# EAGLE design keyfinal (EAGLE 8.6.3)
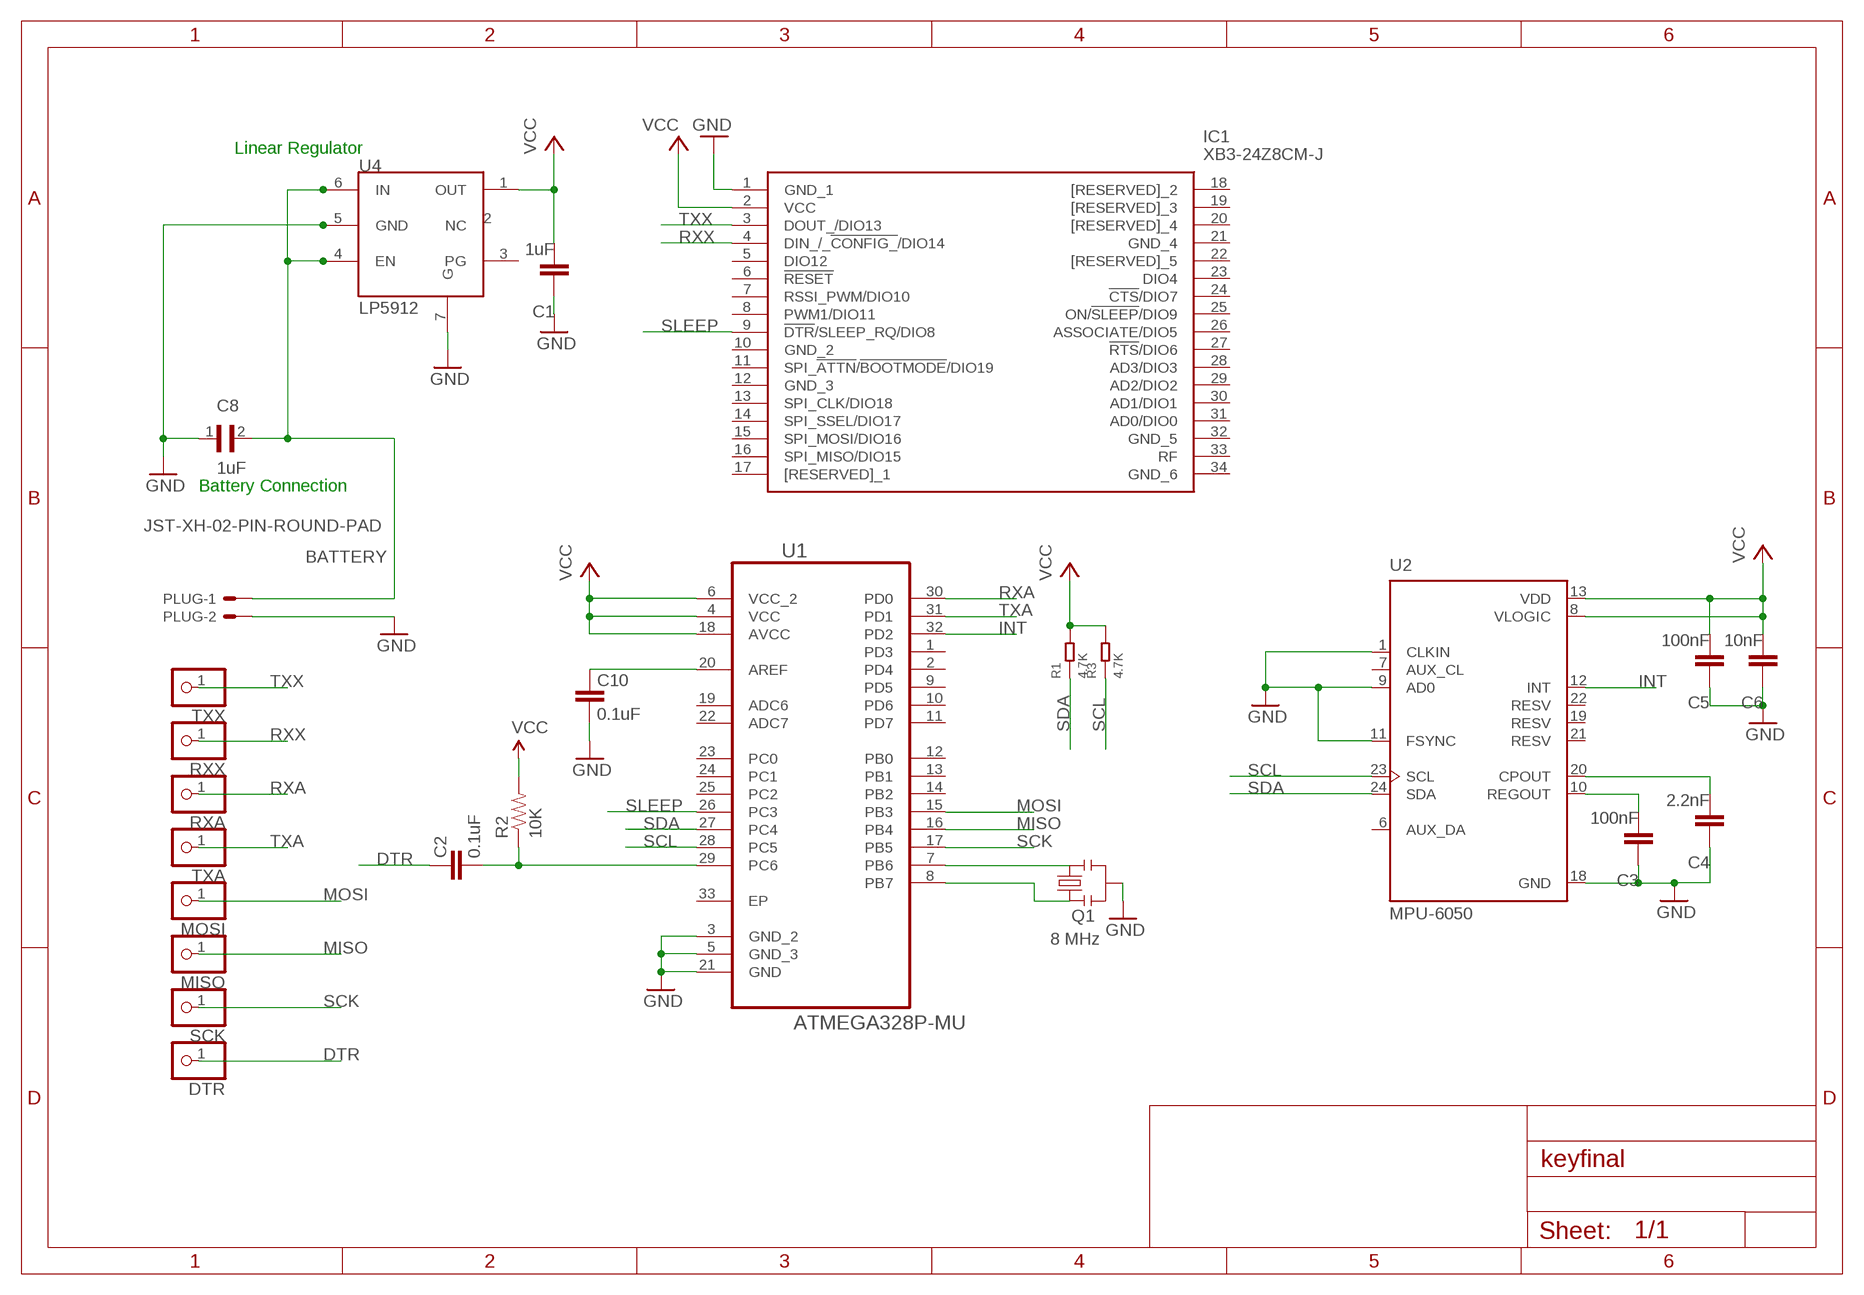
[diagram p0: schematic, sheet 1]

## Parts
C1  1uF  C-EUC0603  [C0603]
C2  0.1uF  CAP0603-CAP  [0603-CAP]
C3  100nF  C-EUC0603  [C0603]
C4  2.2nF  C-EUC0603  [C0603]
C5  100nF  C-EUC0603  [C0603]
C6  10nF  C-EUC0603  [C0603]
C8  1uF  0402YD105MAT2A  [CAPC1005X71N]
C10  0.1uF  CAP0603-CAP  [0603-CAP]
DTR  DTR  PINHD-1X1  [1X01]
IC1  XB3-24Z8CM-J  [XB324Z8CMJ]
MISO  PINHD-1X1  [1X01]
MOSI  PINHD-1X1  [1X01]
PLUG  JST-XH-02-PIN-ROUND-PAD  [JST-XH-02-PACKAGE-ROUND-PAD]
Q1  8 MHz  RESONATOR1:1  [RESONATOR-SMD-1:1]
R1  4.7K  SMD-RES-4.7K-5%-1/16W(0402)  [R0402]
R2  10K  RESISTOR0603-RES  [0603-RES]
R3  4.7K  SMD-RES-4.7K-5%-1/16W(0402)  [R0402]
RXA  PINHD-1X1  [1X01]
RXX  PINHD-1X1  [1X01]
SCK  PINHD-1X1  [1X01]
TXA  PINHD-1X1  [1X01]
TXX  PINHD-1X1  [1X01]
U1  ATMEGA328P-MU  [QFN50P500X500X100-33N]
U2  MPU-6050  [QFN50P400X400X95-24N]
U4  LP5912  [LP5912]

## Nets
BATTERY: C8.2 PLUG.1 U4.4(EN) U4.6(IN)
DTR: C2.2 DTR.1
GND [vcc]: C1.1 C3.1 C4.1 C5.1 C6.1 C8.1 C10.1 IC1.1(GND_1) PLUG.2 Q1.2 U1.3(GND_2) U1.5(GND_3) U1.21(GND) U2.1(CLKIN) U2.9(AD0) U2.11(FSYNC) U2.18(GND) U4.5(GND) U4.7(G)
INT: U1.32(PD2) U2.12(INT)
MISO: MISO.1 U1.16(PB4)
MOSI: MOSI.1 U1.15(PB3)
N$1: C10.2 U1.20(AREF)
N$2: Q1.3 U1.7(PB6)
N$3: C3.2 U2.10(REGOUT)
N$4: C4.2 U2.20(CPOUT)
N$5: Q1.1 U1.8(PB7)
RESET1: C2.1 R2.1 U1.29(PC6)
RXA: RXA.1 U1.30(PD0)
RXX: IC1.4(DIN_/_!CONFIG_!/DIO14) RXX.1
SCK: SCK.1 U1.17(PB5)
SCL: R3.1 U1.28(PC5) U2.23(SCL)
SDA: R1.1 U1.27(PC4) U2.24(SDA)
SLEEP: IC1.9(!DTR!/SLEEP_RQ/DIO8) U1.26(PC3)
TXA: TXA.1 U1.31(PD1)
TXX: IC1.3(DOUT_/DIO13) TXX.1
VCC: C1.2 C5.2 C6.2 IC1.2(VCC) R1.2 R2.2 R3.2 U1.4(VCC) U1.6(VCC_2) U1.18(AVCC) U2.8(VLOGIC) U2.13(VDD) U4.1(OUT)
Unconnected: IC1.5(DIO12) IC1.6(!RESET) IC1.7(RSSI_PWM/DIO10) IC1.8(PWM1/DIO11) IC1.10(GND_2) IC1.11(SPI_!ATTN!/!BOOTMODE!/DIO19) IC1.12(GND_3) IC1.13(SPI_CLK/DIO18) IC1.14(SPI_SSEL/DIO17) IC1.15(SPI_MOSI/DIO16) IC1.16(SPI_MISO/DIO15) IC1.17([RESERVED]_1) IC1.18([RESERVED]_2) IC1.19([RESERVED]_3) IC1.20([RESERVED]_4) IC1.21(GND_4) IC1.22([RESERVED]_5) IC1.23(DIO4) IC1.24(!CTS!/DIO7) IC1.25(ON/!SLEEP!/DIO9) IC1.26(ASSOCIATE/DIO5) IC1.27(!RTS!/DIO6) IC1.28(AD3/DIO3) IC1.29(AD2/DIO2) IC1.30(AD1/DIO1) IC1.31(AD0/DIO0) IC1.32(GND_5) IC1.33(RF) IC1.34(GND_6) U1.1(PD3) U1.2(PD4) U1.9(PD5) U1.10(PD6) U1.11(PD7) U1.12(PB0) U1.13(PB1) U1.14(PB2) U1.19(ADC6) U1.22(ADC7) U1.23(PC0) U1.24(PC1) U1.25(PC2) U1.33(EP) U2.6(AUX_DA) U2.7(AUX_CL) U2.19(RESV) U2.21(RESV) U2.22(RESV) U4.2(NC) U4.3(PG)

## Notes on the sheet
- Linear Regulator
- Battery Connection

## Library data of the parts
C1 C3-C6 = rcl:C-EU: CAPACITOR, European symbol; SPICEPREFIX: C
C2 C10 = SparkFun:CAP: Capacitor Standard 0603 ceramic capacitor, and 0.1" leaded capacitor.
C8 = Capacitor1uF:0402YD105MAT2A: CAP 1UF 16VDC X5R 20% SMD 0402; AVAILABILITY: Unavailable; DESCRIPTION: Cap 1uf 16vdc X5r 20% Smd 0402; MF: AVX; MP: 0402YD105MAT2A; PACKAGE: 1005 AVX; PRICE: None
DTR MISO MOSI RXA RXX TXA TXX = pinhead:PINHD-1X1: PIN HEADER
IC1 = XB3-24Z8CM-J:XB3-24Z8CM-J: Zigbee Modules (802.15.4) XBee3 ,2.4 Ghz ZB 3.0, Chip Ant, MMT Source: Datasheet <https://www.digi.com/resources/documentation/digidocs/pdfs/90001543.pdf>; DESCRIPTION: Zigbee Modules (802.15.4) XBee3 ,2.4 Ghz ZB 3.0, Chip Ant, MMT; HEIGHT: 4mm; MANUFACTURER_NAME: Digi International; MANUFACTURER_PART_NUMBER: XB3-24Z8CM-J; MOUSER_PART_NUMBER: 888-XB3-24Z8CM-J; MOUSER_PRICE-STOCK: https://www.mouser.com/Search/Refine.aspx?Keyword=888-XB3-24Z8CM-J
PLUG = Rembrandt Electronics - JST XH Connectors v1-0:JST-XH-02-PIN: JST XH Connector 2 Pin Wire to board connector. Pitch: 2,54 mm, (0.100") Number of pins: 2 Created by Rembrandt Electronics www.rembrandtelectronics.com
Q1 = Testing:RESONATOR: Resonator Small SMD resonator. This is the itty bitty 10/20MHz resonators with built in caps. CSTCE10M0G55 and CSTCE20M0V53. Footprint for SMD has been used in SFE production for years, and does work okay. 1:1 is an attempt to get larger fillets on the sides so it will be easier to inspect these solders in our AOI machine. The pads have been minimized to match the actual metal under the resonator. To see this relation, it includes an image import of the bottom side of the component. Imported to scale on layer 200.
R1 R3 = RES-4.7K-SMD-5_-1_16W_0402_:SMD-RES-4.7K-5%-1/16W(0402): 301010010; AVAILABILITY: Unavailable; DESCRIPTION: Res Thick Film 0402 4.7K Ohm 5% 0.063W_1/16W_ ?100ppm/C Molded SMD Paper T/R; MF: Yageo; MP: RC0402JR074K7L; PACKAGE: 0402 Yageo; PRICE: None
R2 = SparkFun:RESISTOR: Resistor Basic schematic elements and footprints for 0603, 1206, and PTH resistors.
SCK = pinhead:PINHD-1X1: PIN HEADER; SPICEPREFIX: X
U1 = ATMEGA328P-MU:ATMEGA328P-MU: Programmable Flash; AVAILABILITY: Unavailable; DESCRIPTION: AVR AVR® ATmega Microcontroller IC 8-Bit 20MHz 32KB _16K x 16_ FLASH 32-VQFN _5x5_; MF: Microchip; MP: ATMEGA328P-MU; PACKAGE: VFQFN-32 Adesto Technologies; PRICE: None
U2 = MPU-6050:MPU-6050: MPU-6050 Six-Axis (Gyro + Accelerometer) MEMS MotionTracking™ Devices; AVAILABILITY: Unavailable; DESCRIPTION: 3-axis gyroscope, 3-axis accelerometer in a 4x4x0.9 housing; MF: TDK InvenSense; MP: MPU-6050; PACKAGE: QFN-24 InvenSense; PRICE: None
U4 = electronic-labs:LP5912

## Net classes
0 default: width 0.203 mm
1 vcc: width 0.254 mm

## Board
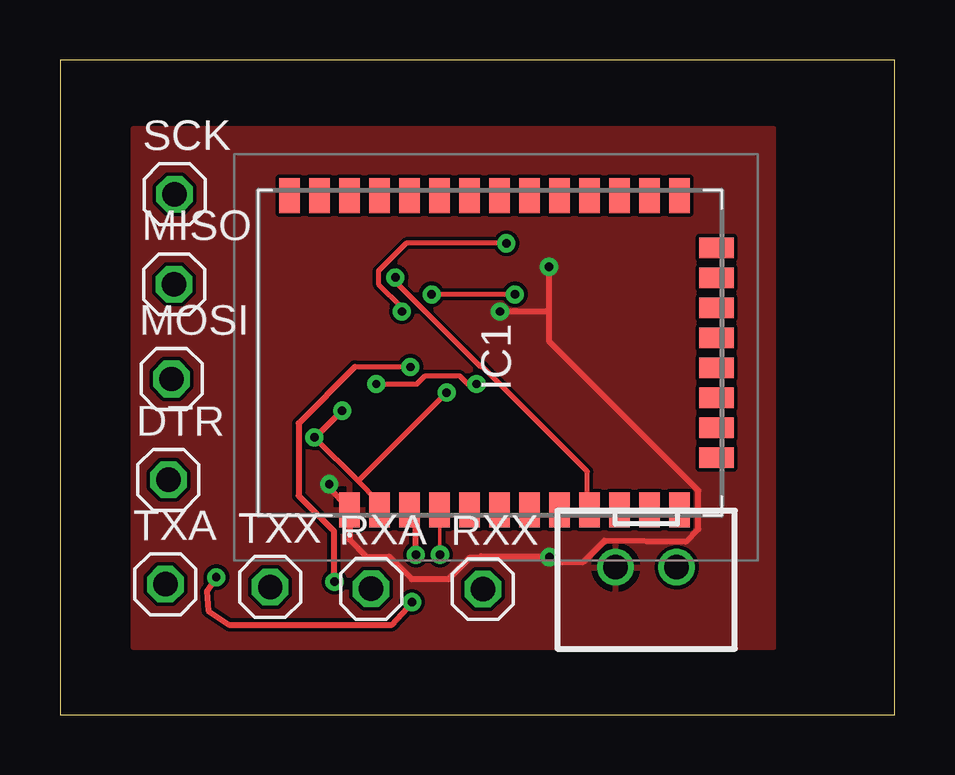
[diagram p1: board, top side]
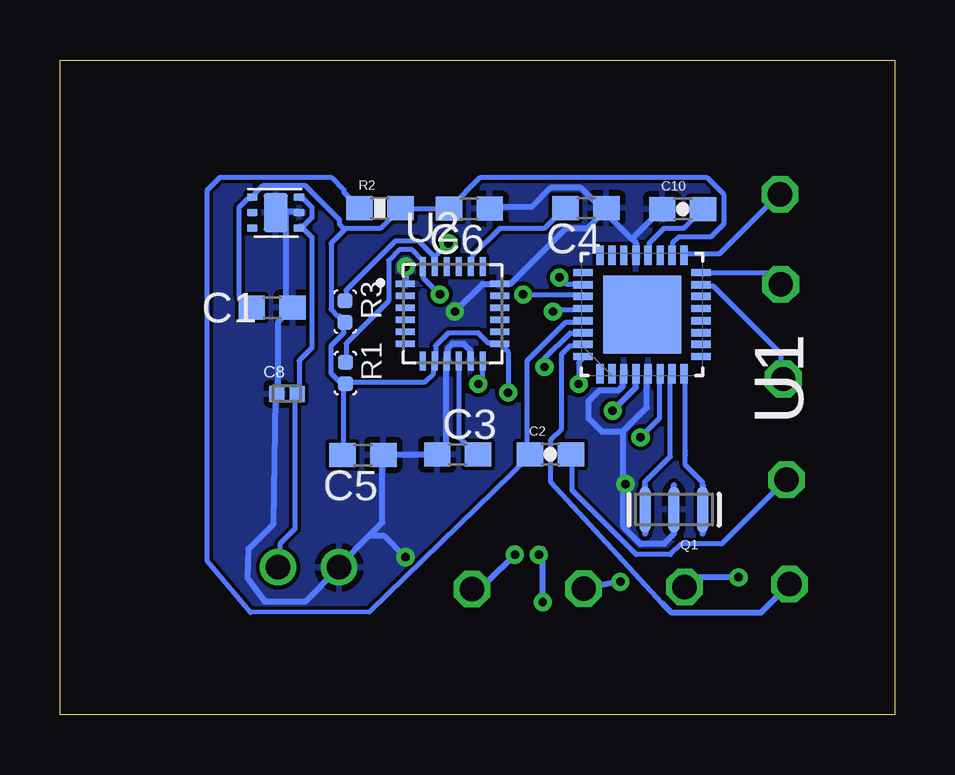
[diagram p2: board, bottom side, seen from below]

Size 34.78 x 27.29 mm. Coordinates in mm from the lower left corner, seen from the top.
Outline: 0,0 34.78,0 34.78,27.29 0,27.29 0,0
Copper layers (1*16): Top 0.035mm / dielectric 1.5mm / Bottom 0.035mm
Design rules "default": minimum track width 6mil, minimum drill 0.35mm, track to track 6mil, track to pad 6mil, pad to pad 6mil, via to via 6mil, smd to smd 6mil, copper to edge 40mil, drill to drill 6mil, minimum pad ring 10mil, minimum via ring 8mil, stop-mask expansion 4mil, vias tented up to drill 0mil, thermal gap 10mil

### Footprints (pad centres in the part's own frame; a part is rotated, then mirrored left to right if it is on the bottom)
C0603 = smd 1.1 x 1: 1 -0.85,0; 2 0.85,0
0603-CAP = smd 1.1 x 1: 1 -0.85,0; 2 0.85,0
CAPC1005X71N = smd 0.62 x 0.67: 1 -0.425,0; 2 0.425,0
1X01 = drill 1.016 octagon: 1 0,0
XB324Z8CMJ = smd 1.448 x 0.838: 1 -6.553,13.75; 2 -6.553,12.5; 3 -6.553,11.25; 4 -6.553,10; 5 -6.553,8.75; 6 -6.553,7.5; 7 -6.553,6.25; 8 -6.553,5; 9 -6.553,3.75; 10 -6.553,2.5; 11 -6.553,1.25; 12 -6.553,0; 21 6.553,0; 22 6.553,1.25; 23 6.553,2.5; 24 6.553,3.75; 25 6.553,5; 26 6.553,6.25; 27 6.553,7.5; 28 6.553,8.75; 29 6.553,10; 30 6.553,11.25; 31 6.553,12.5; 32 6.553,13.75; 33 6.553,15; 34 6.553,16.25 | smd 0.838 x 1.448: 13 -4.375,-1.537; 14 -3.125,-1.537; 15 -1.875,-1.537; 16 -0.625,-1.537; 17 0.625,-1.537; 18 1.875,-1.537; 19 3.125,-1.537; 20 4.375,-1.537
JST-XH-02-PACKAGE-ROUND-PAD = drill 1.016: 1 -1.27,0; 2 1.27,0
RESONATOR-SMD-1:1 = smd 0.45 x 1.905: 1 -1.2,0; 2 0,0; 3 1.2,0
R0402 = smd 0.635 x 0.635: 1 0,0.445; 2 0,-0.445
0603-RES = smd 1.1 x 1: 1 -0.85,0; 2 0.85,0
QFN50P500X500X100-33N = smd 0.813 x 0.305: 1 -2.464,1.753; 2 -2.464,1.245; 3 -2.464,0.762; 4 -2.464,0.254; 5 -2.464,-0.254; 6 -2.464,-0.762; 7 -2.464,-1.245; 8 -2.464,-1.753; 17 2.464,-1.753; 18 2.464,-1.245; 19 2.464,-0.762; 20 2.464,-0.254; 21 2.464,0.254; 22 2.464,0.762; 23 2.464,1.245; 24 2.464,1.753 | smd 0.305 x 0.813: 9 -1.753,-2.464; 10 -1.245,-2.464; 11 -0.762,-2.464; 12 -0.254,-2.464; 13 0.254,-2.464; 14 0.762,-2.464; 15 1.245,-2.464; 16 1.753,-2.464; 25 1.753,2.464; 26 1.245,2.464; 27 0.762,2.464; 28 0.254,2.464; 29 -0.254,2.464; 30 -0.762,2.464; 31 -1.245,2.464; 32 -1.753,2.464 | smd 3.251 x 3.251: 33 0,0
QFN50P400X400X95-24N = smd 0.79 x 0.26: 1 -1.97,1.25; 2 -1.97,0.75; 3 -1.97,0.25; 4 -1.97,-0.25; 5 -1.97,-0.75; 6 -1.97,-1.25; 13 1.97,-1.25; 14 1.97,-0.75; 15 1.97,-0.25; 16 1.97,0.25; 17 1.97,0.75; 18 1.97,1.25 | smd 0.26 x 0.79: 7 -1.25,-1.97; 8 -0.75,-1.97; 9 -0.25,-1.97; 10 0.25,-1.97; 11 0.75,-1.97; 12 1.25,-1.97; 19 1.25,1.97; 20 0.75,1.97; 21 0.25,1.97; 22 -0.25,1.97; 23 -0.75,1.97; 24 -1.25,1.97
LP5912 = smd 0.45 x 0.3: 1 0,0.65; 2 0,0; 3 0,-0.65; 4 1.95,-0.65; 5 1.95,0; 6 1.95,0.65 | smd 1 x 1.6: 7 0.975,0

### Placement (x,y rotation side)
C1  25.95,16.97 180 bottom
C2  14.35,10.85 0 bottom
C3  18.21,10.84 0 bottom
C4  12.86,21.12 180 bottom
C5  22.16,10.83 180 bottom
C6  17.73,21.09 180 bottom
C8  25.33,13.37 0 bottom
C10  8.84,21.07 0 bottom
DTR  4.52,9.79 0 top
IC1  25.81,15.08 90 top
MISO  4.75,17.94 0 top
MOSI  4.65,13.99 0 top
PLUG  24.42,6.14 180 top
Q1  9.2,8.55 180 bottom
R1  22.89,14.24 0 bottom
R2  21.45,21.11 0 bottom
R3  22.9,16.8 0 bottom
RXA  12.96,5.25 0 top
RXX  17.62,5.23 0 top
SCK  4.78,21.7 0 top
TXA  4.39,5.43 0 top
TXX  8.76,5.32 0 top
U1  10.53,16.68 90 bottom
U2  18.42,16.71 0 bottom
U4  26.77,20.93 0 bottom

### Tracks (layer width: path | path; a pad name or v marks a point on that pad's centre or on a via)
BATTERY
  Bottom 0.203: U4.6 24.82,21.51 24.64,21.51 24.29,21.16 24.29,20.71 24.64,20.36 24.82,20.36 U4.4 24.64,20.27 24.29,19.91 24.29,15.29 24.82,14.76 24.82,13.42 C8.2 25,13.34 25,7.74 25.62,7.11 25.62,6.22 PLUG.1
DTR
  Bottom 0.203: C2.2 13.44,10.85 13.44,9.34 10.78,6.67 9.35,6.67 8.91,7.11 7.22,7.11 4.55,9.78 DTR.1
GND  (via drill 0.35)
  Top 0.254: 20.38,16.8 20.38,15.56 26.6,9.34 26.6,7.74 26.07,7.2 22.69,7.25 21.82,6.37 20.58,6.37 v20.39,6.56 20.37,6.54 | 20.38,16.8 v20.38,18.67 | 12.11,8.18 12.11,8.45 IC1.1 | v11.22,9.6 11.22,9.42 12.02,8.62 IC1.1 | 20.38,16.8 v18.33,16.8 | 20.27,6.39 20.37,6.54 | 20.37,6.54 20.45,6.31 20.16,6.6 17.55,6.6 17.49,6.54 17.09,6.54 16.2,5.65 14.65,5.65 13.71,6.58 12.78,6.58 12.06,7.3 IC1.1
  Bottom 0.152: PLUG.2 23.15,6.2 23.13,6.22
  Bottom 0.254: C4.1 12.02,21.07 12.82,20.27 13.71,20.27 16.02,17.96 16.38,17.96 U2.18 16.55,17.96 17.18,17.96 v18.33,16.8 | 10.95,19.83 12.02,20.89 C4.1 | 10.95,19.83 10.78,19.65 10.78,19.2 U1.21 | 10.95,19.83 9.71,21.07 C10.1 | C6.1 16.82,21.16 15.13,21.16 14.33,21.96 13.09,21.96 12.2,21.07 C4.1 | U4.5 24.91,20.98 25.71,20.98 U4.7 25.35,20.89 25.35,16.89 C1.1 25.18,16.89 25.71,16.36 25.71,13.42 C8.1 25.8,13.25 25.88,7.95 26.92,6.92 26.96,5.67 26.26,4.71 24.55,4.72 23.22,6.05 PLUG.2 | U1.5 10.33,14.14 10.33,12.8 11.31,11.82 | 11.31,9.6 11.31,7.82 10.6,7.11 9.62,7.11 9.26,7.47 9.2,7.54 | 11.31,9.6 11.31,11.82 | U2.11 17.71,14.76 17.71,15.2 17.98,15.47 18.42,15.47 18.6,15.29 18.6,14.76 U2.9 18.69,14.67 18.69,11.29 19.04,10.94 C3.1 19.13,10.85 21.27,10.85 C5.1 21.35,10.76 21.35,8 21.91,7.44 | v20.38,18.67 20.38,17.96 U2.1 | 23.13,6.22 21.91,7.44 | v11.22,9.6 11.31,9.6 | v20.39,6.56 21.27,7.44 21.91,7.44 | 11.31,11.82 11.34,11.79 12.2,11.79 12.75,12.34 12.75,13.07 12.3,13.53 11.51,13.53 11.35,13.69 11.35,14.16 U1.3
  pour Bottom: 2.55,24.16 2.55,2.06 29.72,2.06 29.72,24.16
  pour Top: 3.05,24.41 3.05,2.82 29.72,2.82 29.72,24.41
INT  (via drill 0.35)
  Top 0.203: v17.35,13.78 17,13.78 16.64,14.14 15.22,14.14 14.86,13.78 v13.18,13.78
  Bottom 0.203: v17.35,13.78 17.18,13.96 17.18,14.67 U2.12 | v13.18,13.78 13.18,14.67 13,14.85 U1.32
MISO
  Bottom 0.203: U1.16 8.02,18.4 5.26,18.4 4.82,17.96 MISO.1
MOSI
  Bottom 0.203: U1.15 8.02,17.87 7.57,17.87 4.73,15.03 4.73,14.05 MOSI.1
N$1
  Bottom 0.203: U1.20 10.24,19.2 10.24,19.65 9.62,20.27 8.82,20.27 8.02,21.07 C10.2
N$2
  Bottom 0.203: U1.7 9.35,14.14 9.35,10.76 10.42,9.69 Q1.3
N$3
  Bottom 0.203: U2.10 18.15,14.67 18.15,11.56 17.44,10.85 C3.2
N$4
  Bottom 0.203: U2.20 17.62,18.76 17.62,19.11 16.46,20.27 14.6,20.27 13.8,21.07 C4.2
N$5
  Bottom 0.203: U1.8 8.73,14.14 8.73,10.97 8.73,10.82 8.73,10.4 8.02,9.69 Q1.1
RESET1
  Bottom 0.203: U1.29 13,16.36 13.71,16.36 15.31,14.76 15.31,11.02 15.22,10.94 C2.1 15.22,10.76 21.89,4.28 26.84,4.26 28.64,6.4 28.64,21.87 28.11,22.4 23.49,22.4 22.95,21.87 22.95,21.78 22.33,21.16 R2.1
RXA  (via drill 0.35)
  Top 0.203: v14.6,14.49 12.29,14.49
  Top 0.254: 12.29,14.49 9.94,12.15 9.94,9.12 11.41,7.65 11.41,5.62 11.44,5.65 v11.44,5.54
  Bottom 0.203: v14.6,14.49 14.6,14.85 13.53,15.91 U1.30
  Bottom 0.254: v11.44,5.54 11.65,5.52 RXA.1
RXX  (via drill 0.35)
  Top 0.152: IC1.4 15.81,6.68 15.8,6.67 v15.83,6.67
  Bottom 0.254: RXX.1 17,5.5 v15.83,6.67
SCK
  Bottom 0.203: U1.17 8.73,19.2 7.31,19.2 4.82,21.69 SCK.1
SCL  (via drill 0.35)
  Top 0.203: v14.24,16.8 14.24,16.98 13.26,17.96 13.26,18.49 14.42,19.65 v18.6,19.65
  Bottom 0.203: 19.22,19.11 19.84,19.74 20.82,19.74 22.87,17.69 22.87,17.25 R3.1 | 19.22,19.11 19.22,18.76 U2.23 | v14.24,16.8 14.15,16.89 13,16.89 U1.28 | v18.6,19.65 19.13,19.11 19.22,19.11
SDA  (via drill 0.35)
  Top 0.203: v18.95,17.51 v15.49,17.51
  Bottom 0.203: R1.1 22.87,14.76 22.87,15.47 21.09,17.25 21.09,18.94 20.64,19.38 20.11,19.38 19.67,18.94 19.67,18.76 U2.24 19.67,18.58 19.67,18.23 v18.95,17.51 | v15.49,17.51 13,17.51 U1.27
SLEEP  (via drill 0.35)
  Top 0.203: v13.98,18.23 13.98,18.05 17.53,14.49 17.62,14.49 21.98,10.14 21.98,8.54 IC1.9
  Bottom 0.203: v13.98,18.23 13.71,17.96 13,17.96 U1.26
TXA
  Bottom 0.203: 9.48,4.42 9.66,4.62 14.33,9.69 14.33,11.47 13.89,11.91 13.89,15.03 13.53,15.38 13,15.38 U1.31 | 4.46,5.78 TXA.1
  Bottom 0.254: TXA.1 5.58,4.25 9.29,4.25 9.66,4.62
TXX  (via drill 0.35)
  Top 0.254: v6.51,5.72 6.12,5.14 6.19,4.32 7.06,3.73 13.82,3.75 14.67,4.67 v14.67,4.69 | v14.83,6.66 14.83,8.26 IC1.3
  Bottom 0.254: 6.5,5.69 6.46,5.72 | 6.43,5.76 6.46,5.72 | 6.46,5.72 v6.51,5.72 8.35,5.72 TXX.1 | v14.67,4.69 14.67,6.89 14.68,6.88 v14.83,6.66
VCC  (via drill 0.35)
  Top 0.152: 10.64,11.56 10.64,11.51
  Top 0.203: 12.42,9.74 13.26,8.89 13.26,8.54 IC1.2 | 12.42,9.74 10.64,11.51 v10.6,11.56 | v16.11,13.42 12.42,9.74
  Top 0.254: v10.6,11.56 10.64,11.56 v11.76,12.67
  Bottom 0.152: 11.55,12.76 11.67,12.76 v11.76,12.67
  Bottom 0.203: v10.6,11.56 9.8,12.36 9.8,14.14 U1.6 | R1.2 22.95,13.78 22.95,10.85 C5.2 | R1.2 23.04,13.78 23.49,14.23 23.49,15.38 22.95,15.91 22.95,16.27 R3.2 22.95,16.45 23.13,16.63 23.22,16.63 23.49,16.89 23.49,19.65 22.95,20.18 22.95,20.27 | R1.2 22.87,13.87 19.58,13.87 19.22,14.23 19.22,14.67 U2.8 19.13,14.76 19.13,15.38 18.6,15.91 17.35,15.91 16.91,15.47 16.46,15.47 U2.13 16.38,15.38 16.11,15.11 v16.11,13.42 | C1.2 26.87,16.98 27.31,17.43 27.31,21.16 26.95,21.51 26.78,21.51 U4.1 26.69,21.6 26.69,21.69 26.33,22.05 24.55,22.05 23.13,20.63 23.13,20.45 22.95,20.27 | U1.18 9.26,19.2 9.26,19.65 9,19.91 7.66,19.91 7.13,20.45 7.13,21.69 7.84,22.4 17.26,22.4 18.51,21.16 C6.2 18.6,21.07 20.55,21.07 R2.2 20.64,21.07 21.44,20.27 22.95,20.27
  Bottom 0.254: v11.76,12.67 10.79,13.64 U1.4